# Altium project TennisButler.PrjPcb (part 2 of 2)

## Sheet Miscellaneous Connectors.SchDoc: Miscellaneous Connectors
size 228 x 165 mm; DrawnBy: Joseph Riesen; DocumentNumber: 9; Revision: 1.0; SheetNumber: 9; SheetTotal: 10
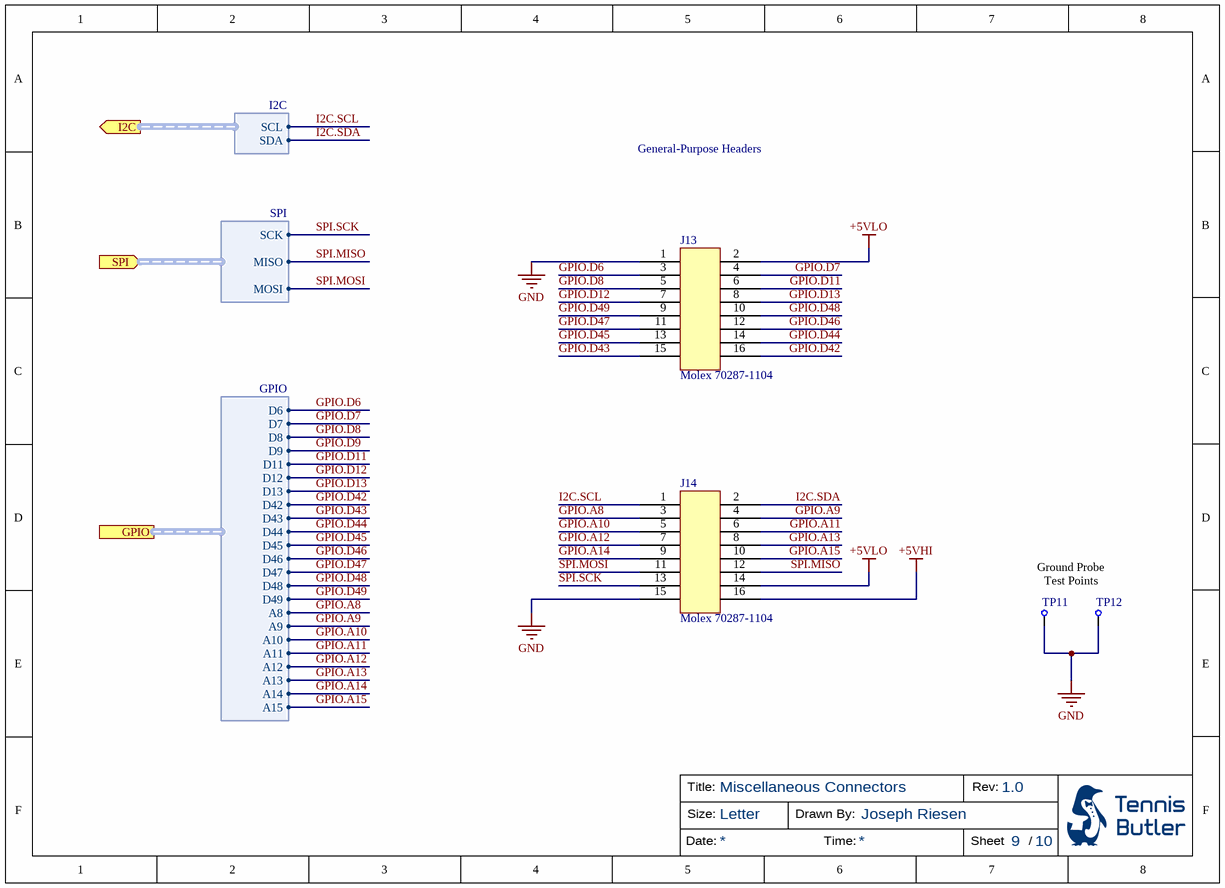
[diagram p8: Miscellaneous Connectors.SchDoc]

### Parts
J13  Molex 70287-1104  [Molex 70287-1104]
J14  Molex 70287-1104  [Molex 70287-1104]
TP11  GND  [Test Point]  (value not drawn)  (no BOM)
TP12  GND  [Test Point]  (value not drawn)  (no BOM)

### Ports
GPIO (harness GPIO), I2C (out, harness I2C), SPI (in, harness SPI)

### Harnesses
I2C: SCL, SDA
SPI: MISO, MOSI, SCK
GPIO: D6, D7, D8, D9, D42, D43, D44, D45, D46, D47, D48, D49, A8, A9, A10, A11, A12, A13, A14, A15, D13, D11, D12

### Nets
+5VHI: J14.16
+5VLO: J13.2 J14.14
GND: J13.1 J14.15 TP11.1 TP12.1
GPIO.A8: J14.3 ; port GPIO.A8  [project net A8]
GPIO.A9: J14.4 ; port GPIO.A9  [project net A9]
GPIO.A10: J14.5 ; port GPIO.A10  [project net A10]
GPIO.A11: J14.6 ; port GPIO.A11  [project net A11]
GPIO.A12: J14.7 ; port GPIO.A12  [project net A12]
GPIO.A13: J14.8 ; port GPIO.A13  [project net A13]
GPIO.A14: J14.9 ; port GPIO.A14  [project net A14]
GPIO.A15: J14.10 ; port GPIO.A15  [project net A15]
GPIO.D6: J13.3 ; port GPIO.D6  [project net D6]
GPIO.D7: J13.4 ; port GPIO.D7  [project net D7]
GPIO.D8: J13.5 ; port GPIO.D8  [project net D8]
GPIO.D9: port GPIO.D9  [project net D9]
GPIO.D11: J13.6 ; port GPIO.D11  [project net D11]
GPIO.D12: J13.7 ; port GPIO.D12  [project net D12]
GPIO.D13: J13.8 ; port GPIO.D13  [project net D13]
GPIO.D42: J13.16 ; port GPIO.D42  [project net D42]
GPIO.D43: J13.15 ; port GPIO.D43  [project net D43]
GPIO.D44: J13.14 ; port GPIO.D44  [project net D44]
GPIO.D45: J13.13 ; port GPIO.D45  [project net D45]
GPIO.D46: J13.12 ; port GPIO.D46  [project net D46]
GPIO.D47: J13.11 ; port GPIO.D47  [project net D47]
GPIO.D48: J13.10 ; port GPIO.D48  [project net D48]
GPIO.D49: J13.9 ; port GPIO.D49  [project net D49]
I2C.SCL: J14.1 ; port I2C.SCL
I2C.SDA: J14.2 ; port I2C.SDA
SPI.MISO: J14.12 ; port SPI.MISO  [project net SPI_CTRLD.MISO]
SPI.MOSI: J14.11 ; port SPI.MOSI  [project net SPI_CTRLD.MOSI]
SPI.SCK: J14.13 ; port SPI.SCK  [project net SPI_CTRLD.SCK]

### Notes on the sheet
- General-Purpose Headers
- Ground Probe Test Points
- Title:
- Size:
- Letter
- Drawn By:
- Rev:
- Date:
- Time:
- Sheet
- /

### Library data of the parts
J13 J14 = Molex 70287-1104 16-Pin (8x2) Male Header: CONN HEADER BKWY DL GOLD 16POS; Manufacturer Part Number: 0702871104; Number of Positions: 16; Max Voltage Rating (DC): 250V; Connector Type: Male Pin; Pitch: 2.54mm; Row Spacing: 0.1inch; Supplier 1: Digi-Key; Manufacturer: Molex; Stock 1: 0; Pricing 1: 2500 = 0.79674 (USD); RoHS 1: Yes; Mount: Through Hole; Contact Plating: Gold; Contact Material: Brass; Housing Material: Thermoplastic; Color: Black; Housing Color: Black; Min Operating Temperature: -40°C; Max Operating Temperature: 120°C; Number of Rows: 2; Packaging: Bulk; Termination: Solder; Orientation: Straight; Number of Contacts: 16; Length: 20.32mm; Contact Mating Length: 0.24inch; Depth: 5.08mm; ComponentLink1URL: https://datasheet.ciiva.com/10080/0702871104-pcb-headers-10080132.pdf?src-supplier=Avnet; ComponentLink1Description: Datasheet 1 (Avnet); ComponentLink2URL: https://datasheet.ciiva.com/2961/702871098-sd-2961617.pdf?src-supplier=Digi-Key; ComponentLink2Description: Datasheet 2 (Digi-Key); Supplier Part Number 1: 0702871104-ND
TP11 TP12 = Test Point

## Sheet SPI Control.SchDoc: SPI Control
size 228 x 165 mm; DrawnBy: Joseph Riesen; DocumentNumber: 10; Revision: 1.0; SheetNumber: 10; SheetTotal: 10
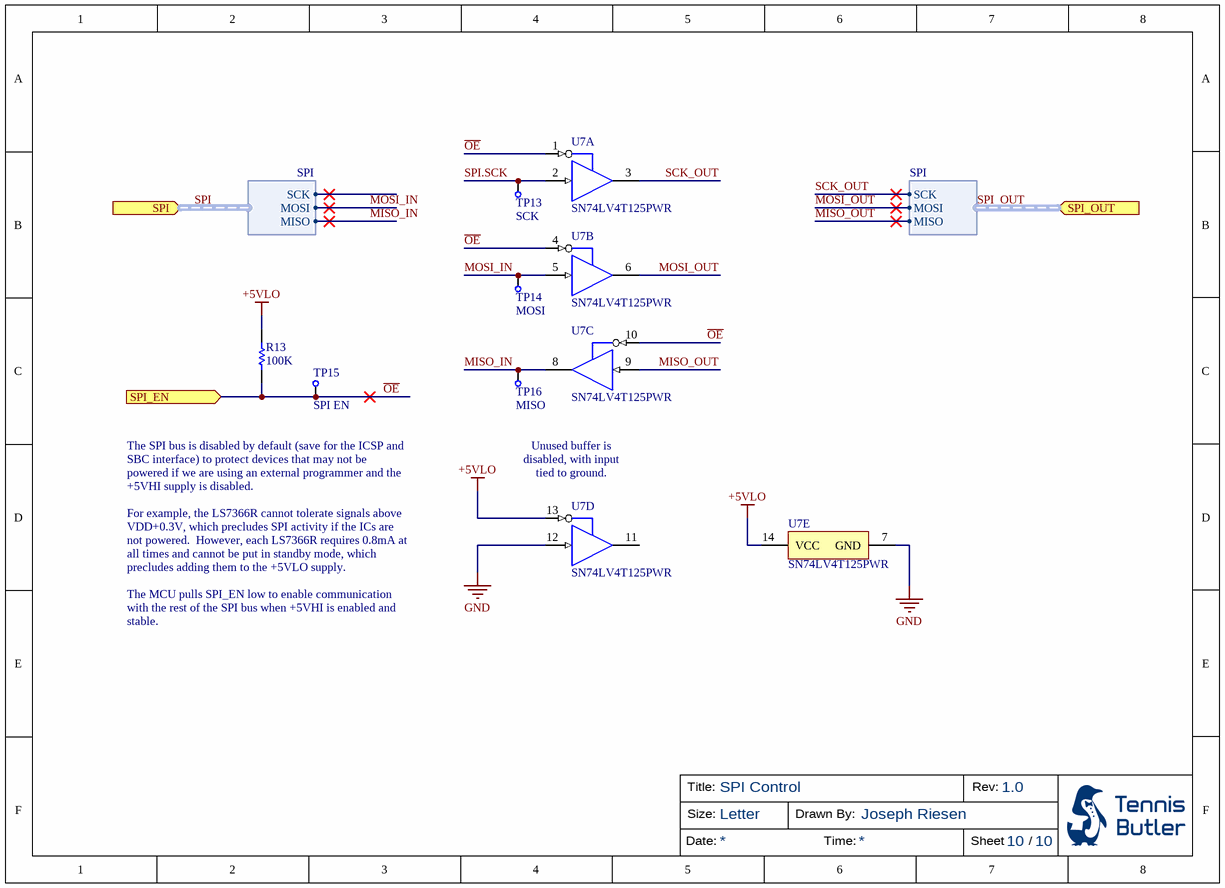
[diagram p9: SPI Control.SchDoc]

### Parts
R13  100K  [RESC2013X70X40ML20T20]
TP13  SCK  [Test Point]  (no BOM)
TP14  MOSI  [Test Point]  (no BOM)
TP15  SPI EN  [Test Point]  (no BOM)
TP16  MISO  [Test Point]  (no BOM)
U7  SN74LV4T125PWR  [TSOP65P640X120-14M]  (parts A,B,C,D,E of 5)

### Ports
SPI (in, harness SPI), SPI_EN (in), SPI_OUT (in, harness SPI)

### Harnesses
SPI: SCK, MOSI, MISO

### Nets
+5VLO: R13.2 U7.13(4~{OE}) U7.14(VCC)
GND: U7.7(GND) U7.12(4A)
MISO_IN: TP16.1 U7.8(3Y) ; port SPI.MISO  [project net SPI.MISO]
MISO_OUT: U7.9(3A) ; port SPI_OUT.MISO  [project net SPI_CTRLD.MISO]
MOSI_IN: TP14.1 U7.5(2A) ; port SPI.MOSI  [project net SPI.MOSI]
MOSI_OUT: U7.6(2Y) ; port SPI_OUT.MOSI  [project net SPI_CTRLD.MOSI]
~{OE}: R13.1 TP15.1 U7.1(1~{OE}) U7.4(2~{OE}) U7.10(3~{OE}) ; port SPI_EN
SCK_OUT: U7.3(1Y) ; port SPI_OUT.SCK  [project net SPI_CTRLD.SCK]
SPI.SCK: TP13.1 U7.2(1A)

Not connected (* = marked no-connect by the designer): U7 11(4Y)

### Buses and harness runs
harness SPI = port SPI
harness SPI_OUT = port SPI_OUT

### Notes on the sheet
- (near U7) Unused buffer is disabled, with input tied to ground.
- The SPI bus is disabled by default (save for the ICSP and SBC interface) to protect devices that may not be powered if we are using an external programmer and the +5VHI supply is disabled.
  For example, the LS7366R cannot tolerate signals above VDD+0.3V, which precludes SPI activity if the ICs are not powered.  However, each LS7366R requires 0.8mA at all times and cannot be put in standby mode, which precludes adding them to the +5VLO supply.
  The MCU pulls SPI_EN low to enable communication with the rest of the SPI bus when +5VHI is enabled and stable.
- Title:
- Size:
- Letter
- Drawn By:
- Rev:
- Date:
- Time:
- Sheet
- /

### Library data of the parts
R13 = CMP-2001-04377-1: RES SMD 100K OHM 1% 1/8W 0805; Part Number: ERJ-6ENF1003V; Manufacturer: Panasonic
TP13-TP16 = Test Point
U7 = SN74LV4T125PWR: Single Power Supply Quadruple Buffer GATE w/ 3-State Output CMOS Logic Level Shifter, PW0014A, LARGE T&R; Manufacturer: Texas Instruments; Number of Elements: 4; Number of Bits per Element: 1; High Level Output Current: 16mA; Quiescent Current: 2uA; Propagation Delay: 11ns; Min Supply Voltage: 1.6V; Max Supply Voltage: 5.5V; Supplier 1: Digi-Key; Manufacturer Part Number: SN74LV4T125PWR; Stock 1: 20583; Pricing 1: 1 = 1.05000, 10 = 0.93600, 100 = 0.72970, 500 = 0.60276, 1000 = 0.47586 (USD); RoHS 1: Yes; Mount: Surface Mount; Case/Package: TSSOP; Number of Pins: 14; Min Operating Temperature: -40°C; Max Operating Temperature: 125°C; Packaging: Tape and Reel; Low Level Output Current: 16mA; Logic Function: Buffer; Number of Bits: 4; Number of Inputs: 1; Package Quantity: 2000; Radiation Hardening: No; Lead Free: Lead Free; REACH SVHC: No SVHC; ComponentLink1URL: https://datasheet.ciiva.com/48438/sn74lv4t125-48438268.pdf?src-supplier=Avnet; ComponentLink1Description: Datasheet (Avnet); Supplier Part Number 1: 296-40545-1-ND

## Nets that join several sheets
+5VHI: M1 (6 pins), Power Management (J2.1 J3.1 J4.1), High-Current Power Supply (6 pins), M2 (6 pins), M3 (6 pins), Miscellaneous Connectors (J14.16)
+5VLO: Low-Current Power Supply (R8.2 TP6.1 U3.5), Microcontroller (U4.10 U4.31 U4.61 U4.80), Microcontroller Support (C8.2 C9.2 C10.2 C11.2), SBC Interface (J12.2 R12.2 U6.19), Miscellaneous Connectors (J13.2 J14.14), SPI Control (R13.2 U7.13 U7.14)
+12V: Power Management (J5.1 Q1.3 R1.2), High-Current Power Supply (J6.1 J6.2), Low-Current Power Supply (C5.2 U2.5 U2.8)
GND: M1 (9 pins), Power Management (7 pins), High-Current Power Supply (9 pins), Low-Current Power Supply (9 pins), Microcontroller (5 pins), Microcontroller Support (10 pins), M2 (9 pins), M3 (9 pins), SBC Interface (J11.1 J12.6 S1.1 U6.11), Miscellaneous Connectors (J13.1 J14.15 TP11.1 TP12.1), SPI Control (U7.7 U7.12)
5VHI_CURRENT: High-Current Power Supply (C2.2 R6.2 TP4.1), Microcontroller (U4.97)
5VHI_EN: High-Current Power Supply (J8.1), Microcontroller (U4.12)
5VHI_PG: High-Current Power Supply (J8.2 R7.1 TP5.1), Microcontroller (U4.95)
5VHI_VOLTAGE: High-Current Power Supply (R3.2 TP2.1), Microcontroller (U4.96)
5VLO_CURRENT: Low-Current Power Supply (C7.2 R9.2 TP7.1), Microcontroller (U4.94)
A8: Microcontroller (U4.89), Miscellaneous Connectors (J14.3)
A9: Microcontroller (U4.88), Miscellaneous Connectors (J14.4)
A10: Microcontroller (U4.87), Miscellaneous Connectors (J14.5)
A11: Microcontroller (U4.86), Miscellaneous Connectors (J14.6)
A12: Microcontroller (U4.85), Miscellaneous Connectors (J14.7)
A13: Microcontroller (U4.84), Miscellaneous Connectors (J14.8)
A14: Microcontroller (U4.83), Miscellaneous Connectors (J14.9)
A15: Microcontroller (U4.82), Miscellaneous Connectors (J14.10)
AREF: Microcontroller (U4.98), Microcontroller Support (C15.2)
AVCC: Microcontroller (U4.100), Microcontroller Support (C12.2)
D6: Microcontroller (U4.15), Miscellaneous Connectors (J13.3)
D7: Microcontroller (U4.16), Miscellaneous Connectors (J13.4)
D8: Microcontroller (U4.17), Miscellaneous Connectors (J13.5)
D11: Microcontroller (U4.24), Miscellaneous Connectors (J13.6)
D12: Microcontroller (U4.25), Miscellaneous Connectors (J13.7)
D13: Microcontroller (U4.26), Miscellaneous Connectors (J13.8)
D42: Microcontroller (U4.42), Miscellaneous Connectors (J13.16)
D43: Microcontroller (U4.41), Miscellaneous Connectors (J13.15)
D44: Microcontroller (U4.40), Miscellaneous Connectors (J13.14)
D45: Microcontroller (U4.39), Miscellaneous Connectors (J13.13)
D46: Microcontroller (U4.38), Miscellaneous Connectors (J13.12)
D47: Microcontroller (U4.37), Miscellaneous Connectors (J13.11)
D48: Microcontroller (U4.36), Miscellaneous Connectors (J13.10)
D49: Microcontroller (U4.35), Miscellaneous Connectors (J13.9)
I2C.SCL: Microcontroller (U4.43), Miscellaneous Connectors (J14.1)
I2C.SDA: Microcontroller (U4.44), Miscellaneous Connectors (J14.2)
MCTL1.ENA: M1 (J9_M1.2), Microcontroller (U4.72)
MCTL1.ENB: M1 (J9_M1.5), Microcontroller (U4.71)
MCTL1.INA: M1 (J9_M1.1), Microcontroller (U4.73)
MCTL1.INB: M1 (J9_M1.6), Microcontroller (U4.70)
MCTL1.PWM: M1 (J9_M1.3 TP8_M1.1), Microcontroller (U4.5)
MCTL1.SENSE: M1 (J9_M1.4), Microcontroller (U4.92)
MCTL2.ENA: Microcontroller (U4.58), M2 (J9_M2.2)
MCTL2.ENB: Microcontroller (U4.57), M2 (J9_M2.5)
MCTL2.INA: Microcontroller (U4.59), M2 (J9_M2.1)
MCTL2.INB: Microcontroller (U4.56), M2 (J9_M2.6)
MCTL2.PWM: Microcontroller (U4.6), M2 (J9_M2.3 TP8_M2.1)
MCTL2.SENSE: Microcontroller (U4.91), M2 (J9_M2.4)
MCTL3.ENA: Microcontroller (U4.53), M3 (J9_M3.2)
MCTL3.ENB: Microcontroller (U4.52), M3 (J9_M3.5)
MCTL3.INA: Microcontroller (U4.54), M3 (J9_M3.1)
MCTL3.INB: Microcontroller (U4.51), M3 (J9_M3.6)
MCTL3.PWM: Microcontroller (U4.7), M3 (J9_M3.3 TP8_M3.1)
MCTL3.SENSE: Microcontroller (U4.90), M3 (J9_M3.4)
~{OE}: Microcontroller (U4.1), SPI Control (5 pins)
~{RESET}: Microcontroller (U4.30), SBC Interface (J12.5 R12.1 S1.2 U6.13)
~{SS}: Microcontroller (U4.19), SBC Interface (U6.17)
~{SS}1: M1 (U5_M1.4), Microcontroller (U4.74)
~{SS}2: Microcontroller (U4.60), M2 (U5_M2.4)
~{SS}3: Microcontroller (U4.55), M3 (U5_M3.4)
SBC_SHDN: Microcontroller (U4.23), SBC Interface (U6.12)
SENSE_EN: High-Current Power Supply (C1.2 U1.3), Low-Current Power Supply (C6.2 U3.3), Microcontroller (U4.13)
SPI.MISO: Microcontroller (U4.22), SBC Interface (J12.1 U6.15), SPI Control (TP16.1 U7.8)
SPI.MOSI: Microcontroller (U4.21), SBC Interface (J12.4 U6.16), SPI Control (TP14.1 U7.5)
SPI.SCK: Microcontroller (U4.20), SBC Interface (J12.3 U6.14)
SPI_CTRLD.MISO: M1 (U5_M1.6), M2 (U5_M2.6), M3 (U5_M3.6), Miscellaneous Connectors (J14.12), SPI Control (U7.9)
SPI_CTRLD.MOSI: M1 (U5_M1.7), M2 (U5_M2.7), M3 (U5_M3.7), Miscellaneous Connectors (J14.11), SPI Control (U7.6)
SPI_CTRLD.SCK: M1 (U5_M1.5), M2 (U5_M2.5), M3 (U5_M3.5), Miscellaneous Connectors (J14.13), SPI Control (U7.3)
UART.RX: Microcontroller (U4.2), SBC Interface (U6.20)
UART.TX: Microcontroller (U4.3), SBC Interface (U6.18)
VBAT_VOLTAGE: Power Management (R1.1 R2.2 TP1.1), Microcontroller (U4.93)
XTAL1: Microcontroller (U4.34), Microcontroller Support (C13.2 R10.2 X1.1)
XTAL2: Microcontroller (U4.33), Microcontroller Support (C14.2 R10.1 X1.3)